# Altium project FSAES-22-E17 Temp Module.PrjPcb
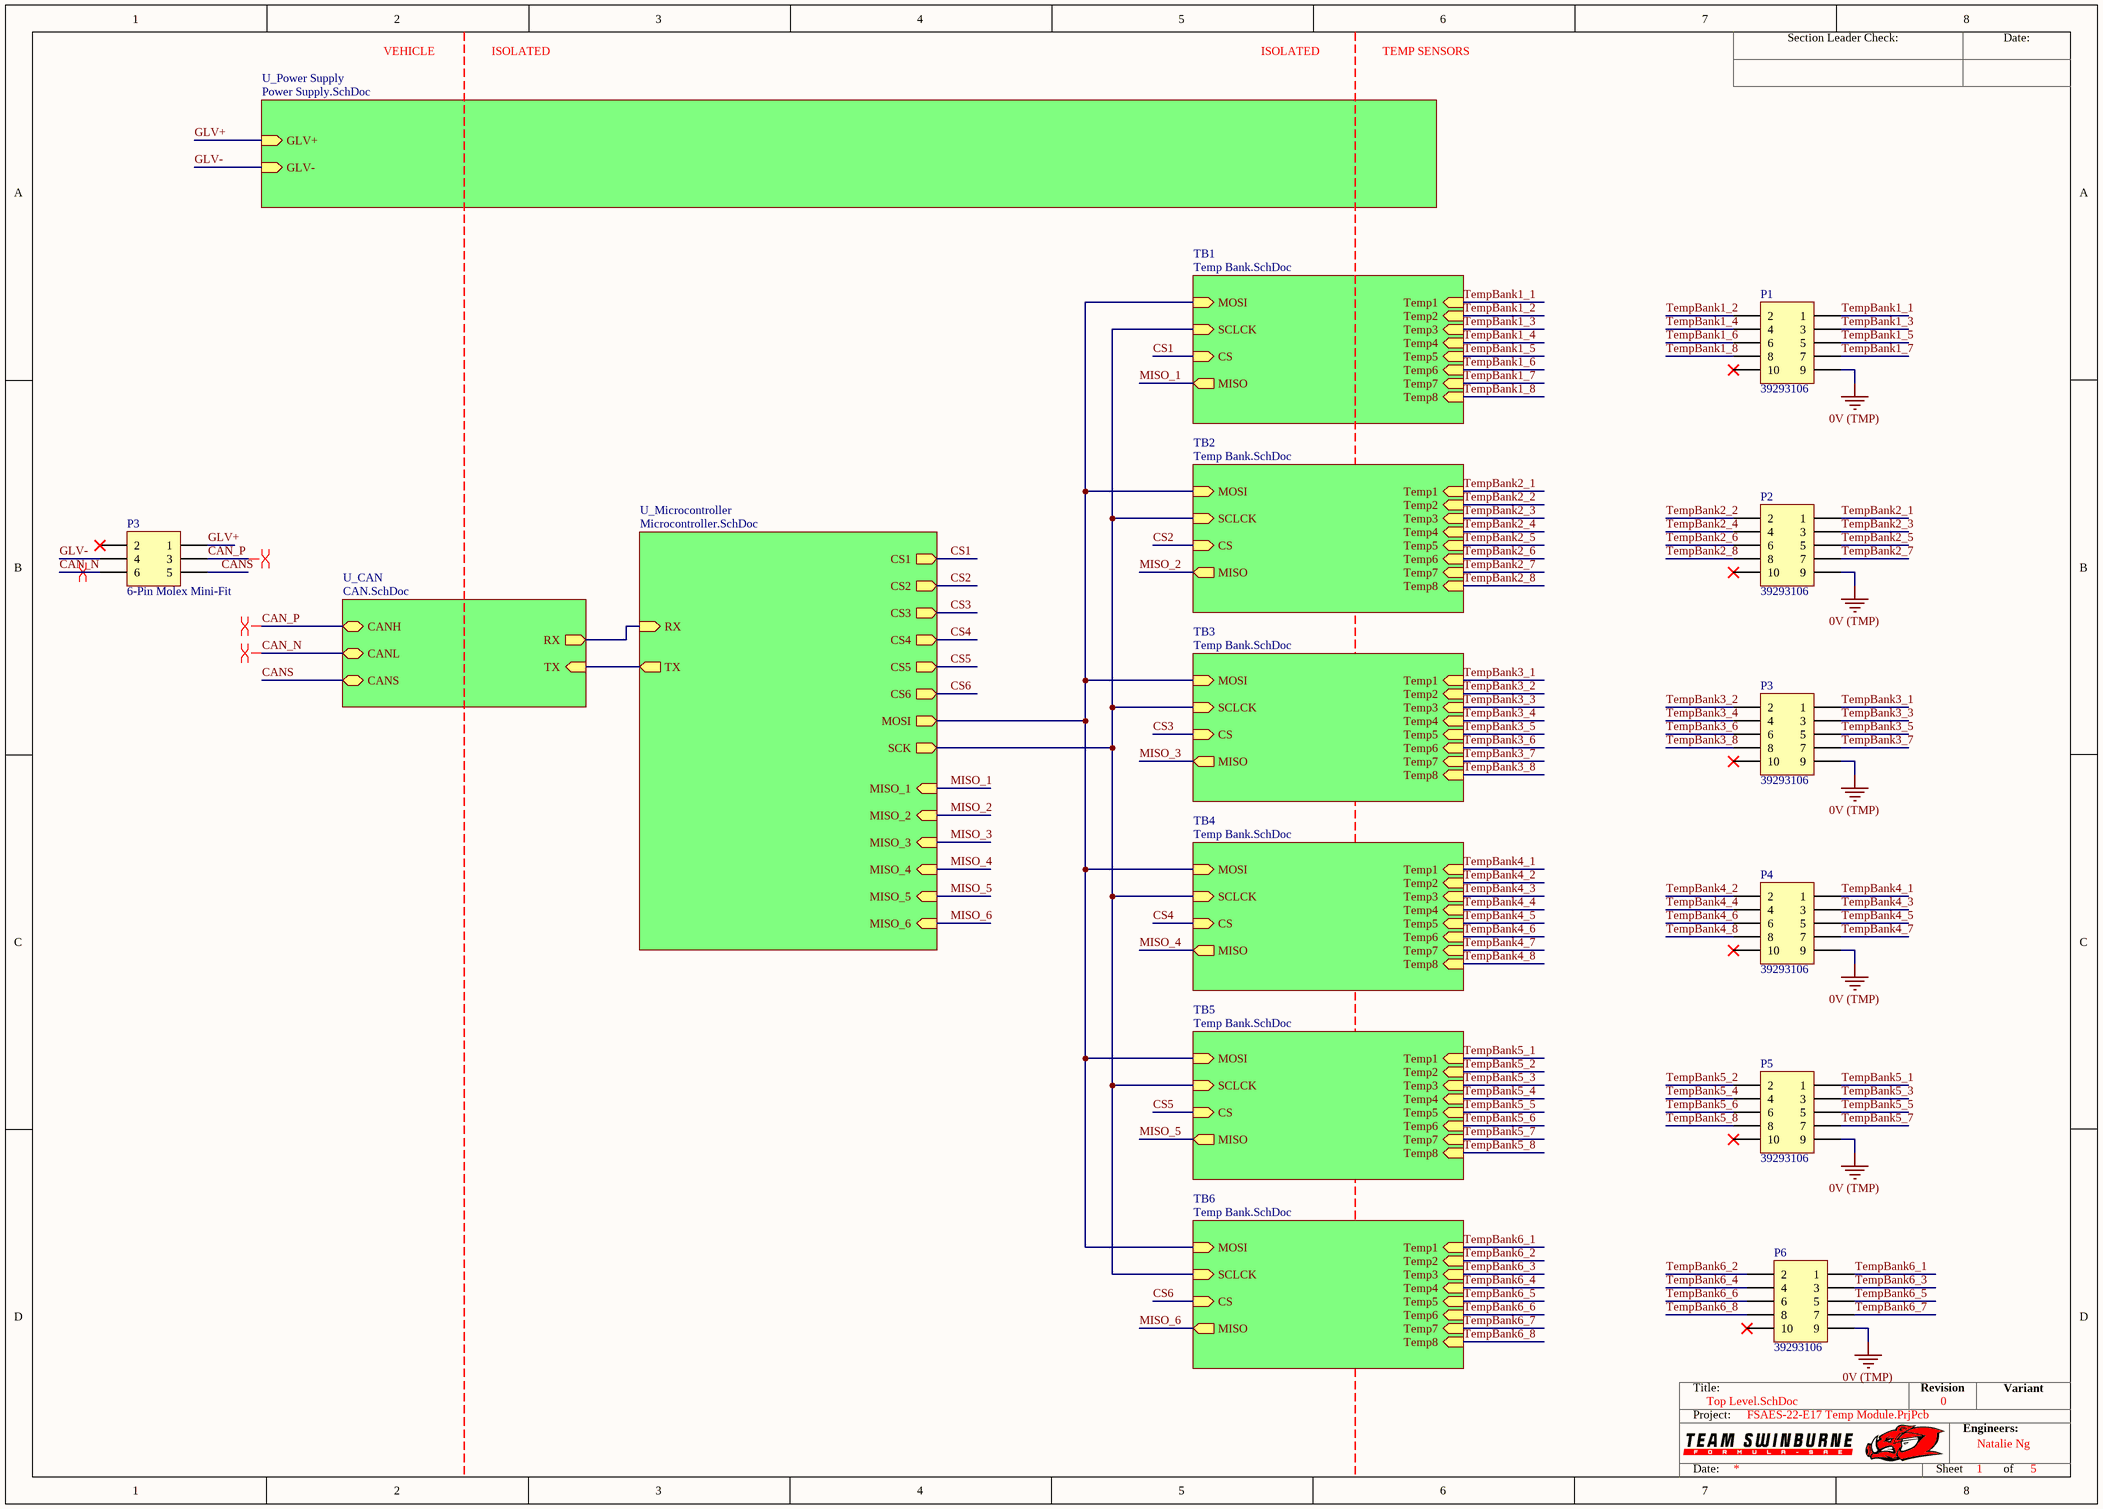
[diagram p0: Top Level.SchDoc]
Engineers: Natalie Ng; Revision: 0
5 sheets, 295 parts. Net scope: hierarchical (ports join the sheet entries above them; power ports are global).
Board file: FSAES-22-E17 Temp Module PCB.PcbDoc
Sheets:
  Top Level.SchDoc
    U_Power Supply = Power Supply.SchDoc
    U_CAN = CAN.SchDoc
    U_Microcontroller = Microcontroller.SchDoc
    TB1 = Temp Bank.SchDoc
    TB2 = Temp Bank.SchDoc
    TB3 = Temp Bank.SchDoc
    TB4 = Temp Bank.SchDoc
    TB5 = Temp Bank.SchDoc
    TB6 = Temp Bank.SchDoc

## Sheet Top Level.SchDoc
size A3; SheetNumber: 1; SheetTotal: 5

### Parts
(Parts that share a designator on the sheet are numbered #1, #2 ... from top to bottom, then left to right.)
P1  39293106  [39293106]
P2  39293106  [39293106]
P3#1  6-Pin Molex Mini-Fit  [6-Pin Molex Mini-Fit]
P3#2  39293106  [39293106]
P4  39293106  [39293106]
P5  39293106  [39293106]
P6  39293106  [39293106]

### Sub-sheets
TB1 = Temp Bank.SchDoc: MOSI (in), SCLCK (in), CS (in), MISO (out), Temp4 (in), Temp5 (in), Temp6 (in), Temp1 (in), Temp2 (in), Temp3 (in), Temp7 (in), Temp8 (in)
TB2 = Temp Bank.SchDoc: MOSI (in), SCLCK (in), CS (in), MISO (out), Temp1 (in), Temp2 (in), Temp3 (in), Temp4 (in), Temp5 (in), Temp6 (in), Temp7 (in), Temp8 (in)
TB3 = Temp Bank.SchDoc: MOSI (in), SCLCK (in), CS (in), MISO (out), Temp1 (in), Temp2 (in), Temp3 (in), Temp4 (in), Temp5 (in), Temp6 (in), Temp7 (in), Temp8 (in)
TB4 = Temp Bank.SchDoc: MOSI (in), SCLCK (in), CS (in), MISO (out), Temp1 (in), Temp2 (in), Temp3 (in), Temp4 (in), Temp5 (in), Temp6 (in), Temp7 (in), Temp8 (in)
TB5 = Temp Bank.SchDoc: MOSI (in), SCLCK (in), CS (in), MISO (out), Temp1 (in), Temp2 (in), Temp3 (in), Temp4 (in), Temp5 (in), Temp6 (in), Temp7 (in), Temp8 (in)
TB6 = Temp Bank.SchDoc: MOSI (in), SCLCK (in), CS (in), MISO (out), Temp1 (in), Temp2 (in), Temp3 (in), Temp4 (in), Temp5 (in), Temp6 (in), Temp7 (in), Temp8 (in)
U_CAN = CAN.SchDoc: CANH (bidir), RX (out), TX (in), CANL (bidir), CANS (bidir)
U_Microcontroller = Microcontroller.SchDoc: CS1 (out), CS2 (out), CS3 (out), CS4 (out), CS5 (out), MOSI (out), CS6 (out), SCK (out), RX (in), TX (out), MISO_6 (in), MISO_5 (in), MISO_4 (in), MISO_3 (in), MISO_2 (in), MISO_1 (in)
U_Power Supply = Power Supply.SchDoc: GLV+ (in), GLV- (in)

### Nets
0V (TMP): P1.9 P2.9 P3#2.9 P4.9 P5.9 P6.9
CAN_N: P3#1.6 ; sheet U_CAN/CANL
CAN_P: P3#1.3 ; sheet U_CAN/CANH
CANS: P3#1.5 ; sheet U_CAN/CANS
CRX1: sheet U_CAN/RX, sheet U_Microcontroller/RX
CS1: sheet U_Microcontroller/CS1, sheet TB1/CS  [project net C1]
CS2: sheet U_Microcontroller/CS2, sheet TB2/CS  [project net C2]
CS3: sheet U_Microcontroller/CS3, sheet TB3/CS  [project net C3]
CS4: sheet U_Microcontroller/CS4, sheet TB4/CS  [project net C4]
CS5: sheet U_Microcontroller/CS5, sheet TB5/CS  [project net C5]
CS6: sheet U_Microcontroller/CS6, sheet TB6/CS  [project net C6]
CTX1: sheet U_CAN/TX, sheet U_Microcontroller/TX
GLV+: P3#1.1 ; sheet U_Power Supply/GLV+
GLV-: P3#1.4 ; sheet U_Power Supply/GLV-
MISO_1: sheet U_Microcontroller/MISO_1, sheet TB1/MISO
MISO_2: sheet U_Microcontroller/MISO_2, sheet TB2/MISO
MISO_3: sheet U_Microcontroller/MISO_3, sheet TB3/MISO
MISO_4: sheet U_Microcontroller/MISO_4, sheet TB4/MISO
MISO_5: sheet U_Microcontroller/MISO_5, sheet TB5/MISO
MISO_6: sheet U_Microcontroller/MISO_6, sheet TB6/MISO
MOSI: sheet U_Microcontroller/MOSI, sheet TB1/MOSI, sheet TB2/MOSI, sheet TB3/MOSI, sheet TB4/MOSI, sheet TB5/MOSI, sheet TB6/MOSI
SCK: sheet U_Microcontroller/SCK, sheet TB1/SCLCK, sheet TB2/SCLCK, sheet TB3/SCLCK, sheet TB4/SCLCK, sheet TB5/SCLCK, sheet TB6/SCLCK
TempBank1_1: P1.1 ; sheet TB1/Temp1
TempBank1_2: P1.2 ; sheet TB1/Temp2
TempBank1_3: P1.3 ; sheet TB1/Temp3
TempBank1_4: P1.4 ; sheet TB1/Temp4
TempBank1_5: P1.5 ; sheet TB1/Temp5
TempBank1_6: P1.6 ; sheet TB1/Temp6
TempBank1_7: P1.7 ; sheet TB1/Temp7
TempBank1_8: P1.8 ; sheet TB1/Temp8
TempBank2_1: P2.1 ; sheet TB2/Temp1
TempBank2_2: P2.2 ; sheet TB2/Temp2
TempBank2_3: P2.3 ; sheet TB2/Temp3
TempBank2_4: P2.4 ; sheet TB2/Temp4
TempBank2_5: P2.5 ; sheet TB2/Temp5
TempBank2_6: P2.6 ; sheet TB2/Temp6
TempBank2_7: P2.7 ; sheet TB2/Temp7
TempBank2_8: P2.8 ; sheet TB2/Temp8
TempBank3_1: P3#2.1 ; sheet TB3/Temp1
TempBank3_2: P3#2.2 ; sheet TB3/Temp2
TempBank3_3: P3#2.3 ; sheet TB3/Temp3
TempBank3_4: P3#2.4 ; sheet TB3/Temp4
TempBank3_5: P3#2.5 ; sheet TB3/Temp5
TempBank3_6: P3#2.6 ; sheet TB3/Temp6
TempBank3_7: P3#2.7 ; sheet TB3/Temp7
TempBank3_8: P3#2.8 ; sheet TB3/Temp8
TempBank4_1: P4.1 ; sheet TB4/Temp1
TempBank4_2: P4.2 ; sheet TB4/Temp2
TempBank4_3: P4.3 ; sheet TB4/Temp3
TempBank4_4: P4.4 ; sheet TB4/Temp4
TempBank4_5: P4.5 ; sheet TB4/Temp5
TempBank4_6: P4.6 ; sheet TB4/Temp6
TempBank4_7: P4.7 ; sheet TB4/Temp7
TempBank4_8: P4.8 ; sheet TB4/Temp8
TempBank5_1: P5.1 ; sheet TB5/Temp1
TempBank5_2: P5.2 ; sheet TB5/Temp2
TempBank5_3: P5.3 ; sheet TB5/Temp3
TempBank5_4: P5.4 ; sheet TB5/Temp4
TempBank5_5: P5.5 ; sheet TB5/Temp5
TempBank5_6: P5.6 ; sheet TB5/Temp6
TempBank5_7: P5.7 ; sheet TB5/Temp7
TempBank5_8: P5.8 ; sheet TB5/Temp8
TempBank6_1: P6.1 ; sheet TB6/Temp1
TempBank6_2: P6.2 ; sheet TB6/Temp2
TempBank6_3: P6.3 ; sheet TB6/Temp3
TempBank6_4: P6.4 ; sheet TB6/Temp4
TempBank6_5: P6.5 ; sheet TB6/Temp5
TempBank6_6: P6.6 ; sheet TB6/Temp6
TempBank6_7: P6.7 ; sheet TB6/Temp7
TempBank6_8: P6.8 ; sheet TB6/Temp8

Not connected (* = marked no-connect by the designer): P1 10*; P2 10*; P3#1 2*; P3#2 10*; P4 10*; P5 10*; P6 10*

### Layout directives
differential pair: CAN_N, CAN_P

### Notes on the sheet
- VEHICLE
- ISOLATED
- TEMP SENSORS
- Section Leader Check:
- Date:
- Title:
- Revision
- Variant
- Project:
- Engineers:
- Sheet
- of

### Library data of the parts
P1 P2 P3#2 P4-P6 = 39293106: Pitch: 4.2mm; Row Spacing: 5.5mm; Angle: 0; Flange: No; Contact: Tin; Part Number: 39293106; Positions: 10; Digikey Part Number: WM3847-ND
P3#1 = CMP-CONN-0004-1: 6-Pin Molex Mini-Fit Connector Header 6 pin mini fit

## Sheet Power Supply.SchDoc
size A4; SheetNumber: 2; SheetTotal: 5
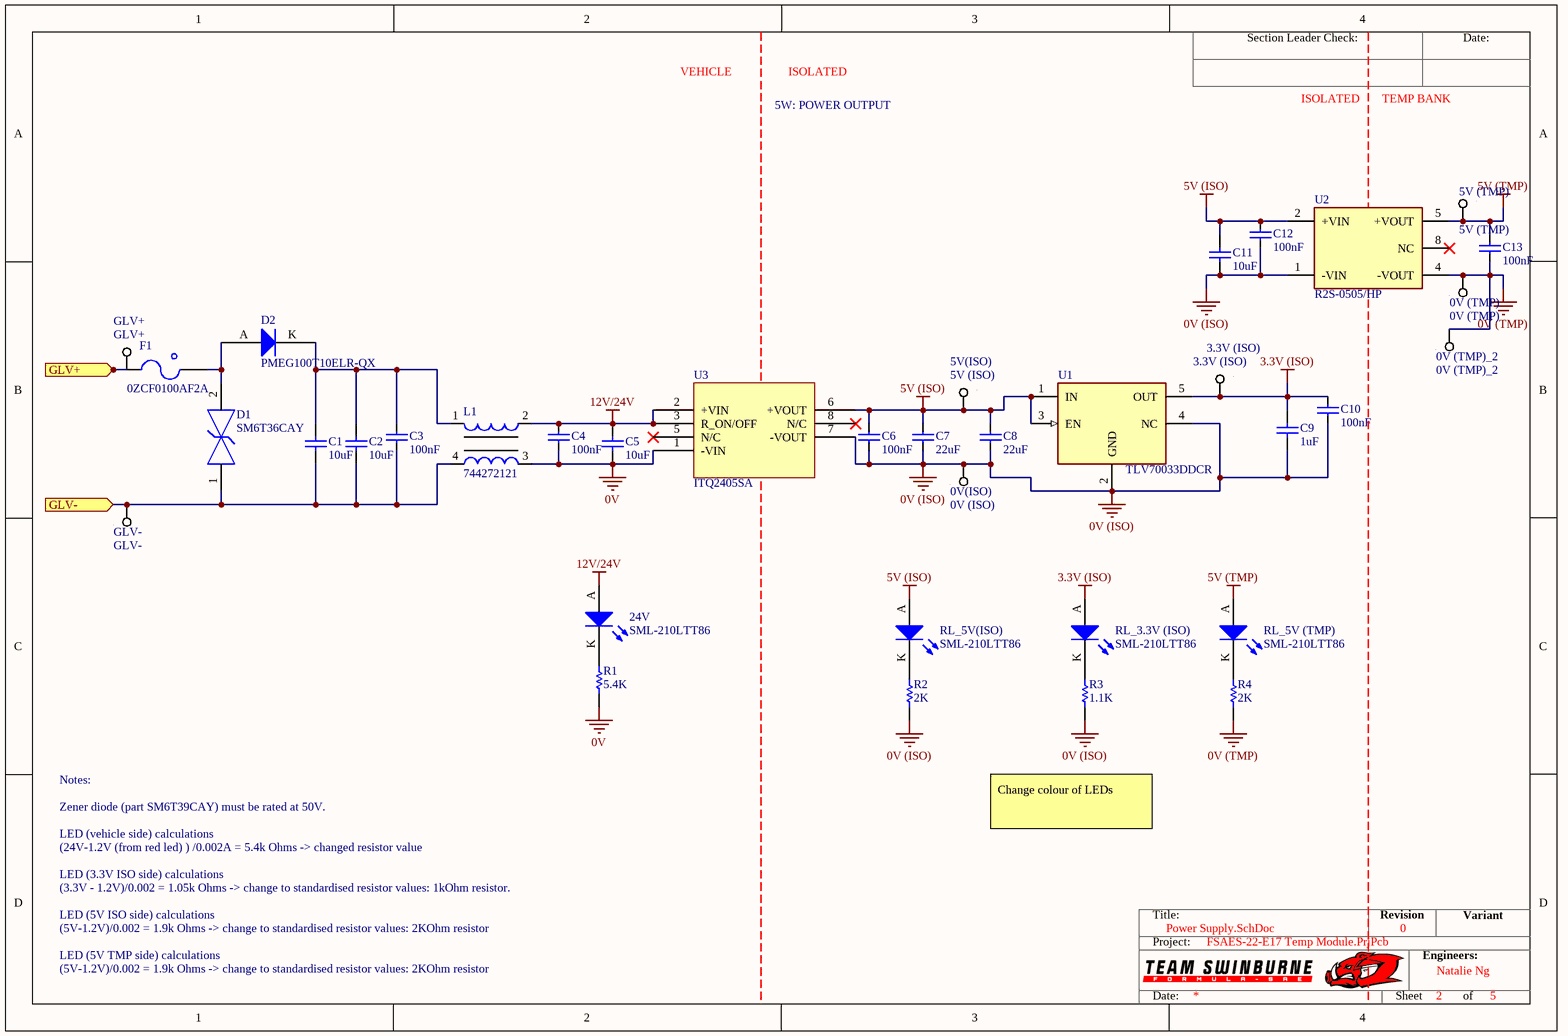
[diagram p1: Power Supply.SchDoc]

### Parts
0V(ISO)  0V (ISO)  [SMD Test Point 1mm]
0V_(TMP)  0V (TMP)  [SMD Test Point 1mm]
0V_(TMP)_2  0V (TMP)_2
3.3V_(ISO)  3.3V (ISO)  [SMD Test Point 1mm]
5V(ISO)  5V (ISO)  [SMD Test Point 1mm]
5V_(TMP)  5V (TMP)  [SMD Test Point 1mm]
24V  SML-210LTT86  [0805 LED]
C1  10uF  [CAPC2013X145X50NL20T25]
C2  10uF  [CAPC2013X145X50NL20T25]
C3  100nF  [0805]
C4  100nF  [0805]
C5  10uF  [CAPC2013X145X50NL20T25]
C6  100nF  [0805]
C7  22uF  [C0805C226M9PAC7210-Footprint-1]
C8  22uF  [C0805C226M9PAC7210-Footprint-1]
C9  1uF  [0805]
C10  100nF  [0805]
C11  10uF  [0805]
C12  100nF  [0805]
C13  100nF  [0805]
D1  SM6T36CAY  [FP-SMB-CA-MFG]
D2  PMEG100T10ELR-QX  [SODFL350X110-2N]
F1  0ZCF0100AF2A  [2920]
GLV+  GLV+  [SMD Test Point 1mm]
GLV-  GLV-  [SMD Test Point 1mm]
L1  744272121  [WE-SL5]
R1  5.4K  [RNCF0805BKY5K40-Footprint-1]
R2  2K  [0805]
R3  1.1K  [RESC0603]
R4  2K  [0805]
RL_3.3V_(ISO)  SML-210LTT86  [0805 LED]
RL_5V(ISO)  SML-210LTT86  [0805 LED]
RL_5V_(TMP)  SML-210LTT86  [0805 LED]
U1  TLV70033DDCR  [FP-DDC0005A-IPC_B]
U2  R2S-0505/HP  [R2S-0505_HP-Footprint-1]
U3  ITQ2405SA  [ITQ2405SA-Footprint-1]

### Ports
GLV+ (in), GLV- (in)

### Nets
0V: C4.2 C5.1 L1.3 R1.1 U3.1(-VIN)
0V (ISO): 0V(ISO).1 C6.2 C7.1 C8.1 C9.1 C10.2 C11.1 C12.2 R2.1 R3.1 U1.2(GND) U1.4(NC) U2.1(-VIN) U3.7(-VOUT)  [project net G1]
0V (TMP): 0V_(TMP).1 0V_(TMP)_2.1 C13.2 R4.1 U2.4(-VOUT)
3.3V (ISO): 3.3V_(ISO).1 C9.2 C10.1 RL_3.3V_(ISO).A U1.5(OUT)
5V (ISO): 5V(ISO).1 C6.1 C7.2 C8.2 C11.2 C12.1 RL_5V(ISO).A U1.1(IN) U1.3(EN) U2.2(+VIN) U3.6(+VOUT)
5V (TMP): 5V_(TMP).1 C13.1 RL_5V_(TMP).A U2.5(+VOUT)
12V/24V: 24V.A C4.1 C5.2 L1.2 U3.2(+VIN) U3.3(R_ON/OFF)
GLV+: F1.1 GLV+.1 ; port GLV+
GLV-: C1.1 C2.1 C3.2 D1.1 GLV-.1 L1.4 ; port GLV-
Net24V_K: 24V.K R1.2
NetC1_2: C1.2 C2.2 C3.1 D2.K L1.1
NetD1_2: D1.2 D2.A F1.2
NetR2_2: R2.2 RL_5V(ISO).K
NetR3_2: R3.2 RL_3.3V_(ISO).K
NetR4_2: R4.2 RL_5V_(TMP).K

Not connected (* = marked no-connect by the designer): U2 8(NC)*; U3 5(N/C)* 8(N/C)*

### Notes on the sheet
- VEHICLE
- 5W: POWER OUTPUT
- ISOLATED
- TEMP BANK
- Notes:
- (24V-1.2V (from red led) ) /0.002A = 5.4k Ohms -> changed resistor value
- LED (vehicle side) calculations
- Zener diode (part SM6T39CAY) must be rated at 50V.
- Change colour of LEDs
- LED (3.3V ISO side) calculations
- (3.3V - 1.2V)/0.002 = 1.05k Ohms -> change to standardised resistor values: 1kOhm resistor.
- LED (5V ISO side) calculations
- (5V-1.2V)/0.002 = 1.9k Ohms -> change to standardised resistor values: 2KOhm resistor
- LED (5V TMP side) calculations
- Section Leader Check:
- Date:
- Title:
- Revision
- Variant
- Project:
- Engineers:
- Sheet
- of
- (in symbol GRM21BR6YA106KE43L) 0805

### Library data of the parts
0V(ISO) 0V_(TMP) 3.3V_(ISO) 5V(ISO) 5V_(TMP) GLV+ GLV- = SMD Test Point Small: Positions: 1; Pitch: 0mm; Row Spacing: 0; Flange: No; Contact: NA; Part Number: SMD Test Point Small; Angle: 0
0V_(TMP)_2 = CMP-061-000001-1: Design Item ID: Test Point Small; Source: Generic.SchLib
24V RL_3.3V_(ISO) RL_5V(ISO) RL_5V_(TMP) = CMP-025-000006-1: Red LED Indication - Discrete 1.75V 0805 (2012 Metric); Part Number: SML-210LTT86
C1 C2 C5 = CMP-CAP-0009-1: CAP CER 10UF 10V Y5V 0805; Dissipation Factor: 20%; Tolerance: 80%; Dielectric Material: Ceramic; Lead Free: Lead Free; Construction: Flat; Number of Pins: 2; Package Quantity: 1; Max Operating Temperature: 85°C; Resistor Type: Ceramic; Dielectric: Y5V; Capacitance: 10uF; Width: 0.049inch; REACH SVHC: No SVHC; Length: 2mm; Mount: Surface Mount; Case Code (Imperial): 0805; Case/Package: 0805; Termination: SMD/SMT; RoHS Compliant: Yes; Series: CC; Voltage Rating: 10V; Packaging: Tape and Reel; Depth: 1.25mm; Voltage Rating (DC): 10V; Height: 0.85mm; Thickness: 0.049inch; Case Code (Metric): 2012; Halogen Free: Halogen Free; Radiation Hardening: No; Min Operating Temperature: -30°C
C3 C4 C6 C10 C12 C13 = CMP-00018-1: Cap Ceramic 0.1uF 25V X7R 10% Pad SMD 0805 125C Automotive T/R; Max Operating Temperature: 125°C; RoHS Compliant: Yes; Series: GCM; Case Code (Metric): 2012; Thickness: 0.055inch; Depth: 1.25mm; Width: 1.25mm; Package Quantity: 3000; Case Code (Imperial): 0805; Voltage Rating (DC): 25V; Dielectric: X7R; Construction: Flat; Height: 1.25mm; Ratings: AEC-Q200; Mount: Surface Mount; Voltage Rating: 25V; Tolerance: 10%; Length: 2mm; Case/Package: 0805; Packaging: Tape and Reel; Min Operating Temperature: -55°C; Radiation Hardening: No; Capacitance: 100nF; Termination: SMD/SMT
C7 C8 = CMP-CAP-0012-1: Cap Ceramic 22uF 6.3V X5R 20% Pad SMD 0805 85C T/R; Length: 2mm; Tolerance: 20%; Depth: 1.25mm; ComponentLink1URL: https://www.digikey.com.au/en/products/detail/kemet/C0805C226M9PAC7210/12701503?utm_adgroup=Ceramic%20Capacitors&utm_source=google&utm_medium=cpc&utm_campaign=Shopping_Product_Capacitors&utm_term=&productid=12701503&utm_id=go_cmp-1056236628_adg-53401090298_ad-250137101738_pla-354083418645_dev-c_ext-_prd-12701503_sig-CjwKCAjwnZaVBhA6EiwAVVyv9KTEcqdxbqdQeMdm15seaf-EwUH-KMZCmj15MsoZE7WO92Q0RAY2FRoCkrcQAvD_BwE&gclid=CjwKCAjwnZaVBhA6EiwAVVyv9KTEcqdxbqdQeMdm15seaf-EwUH-KMZCmj15MsoZE7WO92Q0RAY2FRoCkrcQAvD_BwE; Min Operating Temperature: -55°C; RoHS Compliant: Yes; Packaging: Tape and Reel; Dielectric: X5R; Capacitance: 22uF; ComponentLink1Description: Digikey Link; Max Operating Temperature: 85°C; Case/Package: 0805
C9 = AC0805KKX7R8BB105: Manufacturer: YAGEO; Tolerance: 10%; Material: X7R; Rated Voltage: 25V; Part Number: AC0805KKX7R8BB105; Value: 1uF; Digikey Part Number: DO NOT USE FOR NEW DESIGNS
C11 = GRM21BR6YA106KE43L: Manufacturer: muRata; Tolerance: 10%; Material: X5R; Rated Voltage: 50V; Part Number: GRM21BR6YA106KE43L; Value: 10uF; Digikey Part Number: 490-10514-6-ND
D1 = CMP-004-00004-1: ESD Suppressors / TVS Diodes 600 W 4kW Transil 6V to 70V Bi; Number of Bidirectional Channels: 1; Leakage Current: 200nA; Peak Pulse Power: 600W; Test Current: 1mA; Clamping Voltage: 49.9V; Direction: Bidirectional; Operating Supply Voltage: 30V; Peak Pulse Current: 62A; Max Breakdown Voltage: 37.8V; Breakdown Voltage: 36V; Max Surge Current: 12A; Min Breakdown Voltage: 34.2V; Power Line Protection: No; Diode Type: ZENER; Reverse Standoff Voltage: 30.8V; Lead Free: Contains Lead; Mounting Technology: Surface Mount; Termination: SMD/SMT; Series: Automotive, AEC-Q101, SM6TY, TRANSIL™; Height: 2.45mm; Min Operating Temperature: -55°C; Reach SVHC Compliant: No; Max Power Dissipation: 600W; Case/Package: DO-214AA; Max Reverse Leakage Current: 200nA; Polarity: Bidirectional; Number of Elements: 1; Package Quantity: 1; RoHS Compliant: Yes; Packaging: Tape and Reel; Max Operating Temperature: 150°C; Width: 3.95mm; Reverse Breakdown Voltage: 34.2V; Number of Channels: 1; Length: 4.6mm; Pins: 2
D2 = CMP-004-00005-4: Diode 100 V 1A Surface Mount SOD-123W
F1 = CMP-018-000004-1: PTC RESET FUSE 60V 1A 292; Part Number: 0ZCF0100AF2A
L1 = CMP-00010-1: CMC 120UH 2.5A 2LN 460 OHM SMD; Voltage Rating (DC): 80V; Inductance Tolerance: 40%; Max Current Rating: 3A; Number of Lines: 2; Test Frequency: 100kHz; Resistance: 25mR; Core Material: Ferrite; Impedance: 460R; Max Operating Temperature: 125°C; Depth: 8.7mm; Min Operating Temperature: -40°C; Current Rating: 2.5A; Tolerance: 40%; Number of Pins: 4; Case/Package: SMD/SMT; Weight: 0.026103oz; Inductance: 120uH; Package Quantity: 1; Current: 2.5A; Width: 0.343inch; RoHS Compliant: Yes; Length: 0.394inch; DC Resistance (DCR): 25mR; Mount: Surface Mount; Termination: SMD/SMT; Packaging: Tape and Reel; Lead Free: Lead Free; Self Resonant Frequency: 100kHz; Height: 6.5mm; Series: WE-SL5; Max DC Current: 2.5A; Voltage Rating: 80V; REACH SVHC: No SVHC
R1 = CMP-RES-0158-2: RES SMD 5.4K OHM 0.125W 0805; Temperature Coefficient: 5ppm/°C; Max Power Dissipation: 125mW; Tolerance: 0.1%; Resistance: 5.4kR; Power Rating: 100mW; Series: RNCF; Packaging: Tape and Reel; RoHS Compliant: Yes; Min Operating Temperature: -55°C; Features: Automotive AEC-Q200; Mount: Surface Mount; Case/Package: 0805; Number of Terminations: 2; Max Operating Temperature: 155°C
R2 R4 = CMP-037-000309-3: RC0805FR072KL; Tolerance: 0.01; Rated Voltage: 0.125W; Value: 2k; Digikey Part Number: 311-2.00KCRCT-ND; Material: FR-07
R3 = CMP-RES-0079-1: RES SMD 1.1K OHM JUMPER 1/10W 0603; Voltage Rating: 50V; Tolerance: 1%; Power Rating: 100mW; Max Operating Temperature: 155°C; Case/Package: 0603; Min Operating Temperature: -55°C
U1 = CMP-001-0011-2: Fixed Positive LDO Regulator, 3.3V, 0.25V Dropout, PMOS, PDSO5; Dropout Voltage1-Nom: 175mV; Input Voltage Absolute-Max: 6V; Package Equivalence Code: TSOP5/6,.11,37; Package Body Material: Plastic; Voltage Tolerance-Max: 2%; Max Supply Voltage: 5.5V; Channels: 1; Dropout Voltage1-Max: 250mV; Regulator Type: FIXED POSITIVE SINGLE OUTPUT LDO REGULATOR; Output Current1-Max: 200mA; Min Input Voltage: 2V; Output Voltage1-Min: 3.234V; Load Regulation-Max: 0.015%; Line Regulation-Max: 0.005%; Output Voltage1-Max: 3.366V; Qualification Status: Not Qualified; Reach SVHC Compliant: Yes; JESD-30 Code: R-PDSO-G5; Terminal Position: DUAL; Pins: 5; Moisture Sensitivity Level: 2; Length: 2.9mm; Operating Temperature, TJ-Min: -40°C; Operating Temperature, TJ-Max: 125°C; Package Shape: Rectangular; Output Voltage1-Nom: 3.3V; Packaging: Tape and Reel; Surface Mount: Yes; Number of Outputs: 1; JESD-609 Code: e4; Adjustability: FIXED; Technology: PMOS; Peak Reflow Temperature (Cel): 260°C; Terminal Form: Gull Wing; Case/Package: TSSOP; Height - Seated (Max): 1.1mm; Package Style: SMALL OUTLINE, THIN PROFILE, SHRINK PITCHMeter; Terminal Finish: Nickel; RoHS Compliant: Yes; Terminal Pitch: 0.95mm; Width: 1.6mm
U2 = CMP-00025-2: DC-DC Unregulated Power Supply Module, 1 Output, 2W, Hybrid; Max Output Voltage: 5.25V; Min Input Voltage: 4.5V; Qualification Status: Not Qualified; Number of Functions: 1; Max Input Voltage: 5.5V; Nominal Output Voltage: 5V; Trim/Adjustable Output: No; Max Output Current: 400mA; Min Output Voltage: 4.75V; Load Regulation-Max: 15%; Terminal Position: DUAL; Width: 10.7mm; Number of Pins: 5; Package Shape: Rectangular; Max Operating Temperature: 100°C; Package Style: MICROELECTRONIC ASSEMBLYMeter; RoHS Compliant: Yes; Package Code: SOP; Height - Seated (Max): 9.5mm; Analog IC - Other Type: DC-DC UNREGULATED POWER SUPPLY MODULE; Temperature Grade: INDUSTRIAL; Terminal Form: Flat; Reach SVHC Compliant: Yes; Min Operating Temperature: -40°C; Length: 12.75mm; Max Output Power: 2W; Number of Outputs: 1; Surface Mount: Yes; Terminal Pitch: 2.54mm; Nominal Input Voltage: 5V; Technology: HYBRID
U3 = CMP-001-0010-2: Dc-dc Converter, 6W Single O/p, 4: 1 Input Sip; Max Output current: 1.2A; Min Input Voltage (DC): 9V; Voltage - Output 1: 5V; Max Supply Voltage: 36V; Isolation Voltage: 1.5kV; Number of Outputs: 1; Efficiency: 84%; Reach SVHC Compliant: Unknown; Current - Output 1: 1.2A; Min Operating Temperature: -40°C; Packaging: Rail/Tube; Features: SCP; RoHS Compliant: Yes; Max Power Dissipation: 6W; Width: 0.36inch; Mounting Technology: Through Hole,PCB; Case/Package: SIP; Output Power: 6W; Max Operating Temperature: 100°C; Max Output Power: 6W; Height: 0.44inch; Max Input Voltage (DC): 36V; Length: 0.86inch; Series: ITQ; Min Input Voltage: 9V; Depth: 21.85mm

## Sheet CAN.SchDoc
size A4; SheetNumber: 3; SheetTotal: 5
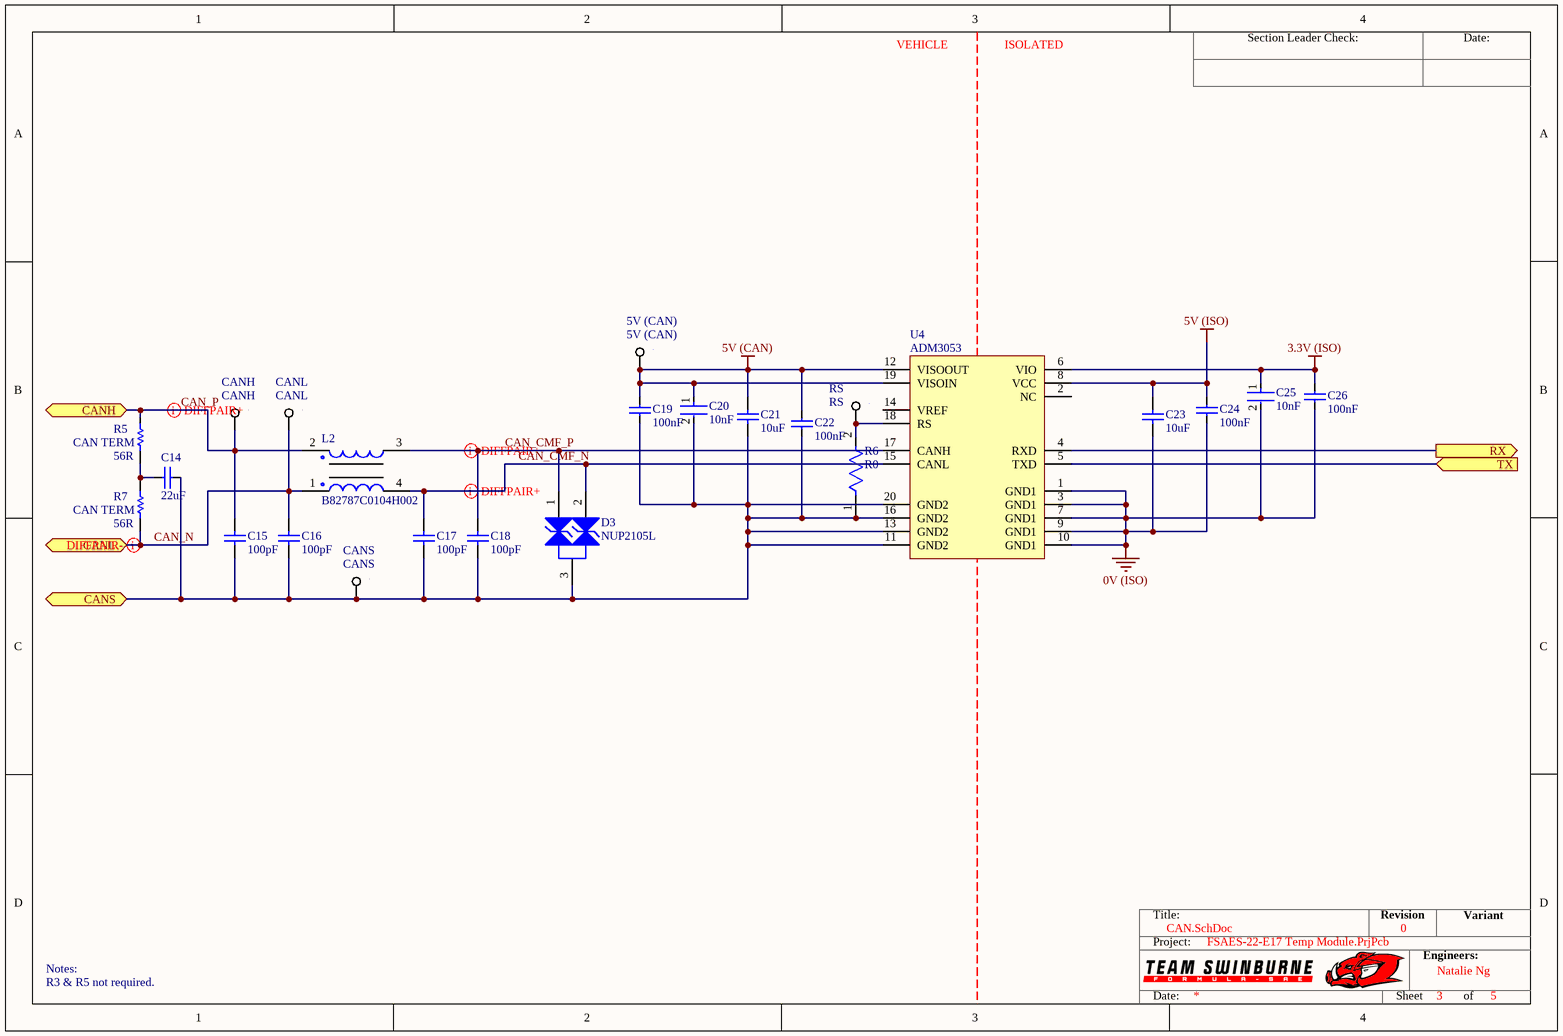
[diagram p2: CAN.SchDoc]

### Parts
5V_(CAN)  5V (CAN)  [SMD Test Point 1mm]
C14  22uF  [C0805C226M9PAC7210-Footprint-1]
C15  100pF  [CAPC2013X70X45NL15T25]
C16  100pF  [CAPC2013X70X45NL15T25]
C17  100pF  [CAPC2013X70X45NL15T25]
C18  100pF  [CAPC2013X70X45NL15T25]
C19  100nF  [0805]
C20  10nF  [FP-GCM319-0_15-IPC_A]
C21  10uF  [CAPC2013X145X50NL20T25]
C22  100nF  [0805]
C23  10uF  [CAPC2013X145X50NL20T25]
C24  100nF  [0805]
C25  10nF  [FP-GCM319-0_15-IPC_A]
C26  100nF  [0805]
CANH  CANH  [SMD Test Point 1mm]
CANL  CANL  [SMD Test Point 1mm]
CANS  CANS  [SMD Test Point 1mm]
D3  NUP2105L  [ONSC-SOT-23-3-318-08_V]
L2  B82787C0104H002  [TDK 4-PC Pad]
R5  CAN TERM  value 56R  [RESC0603]
R6  R0  [FP-RC0805-IPC_A]
R7  CAN TERM  value 56R  [RESC0603]
RS  RS  [SMD Test Point 1mm]
U4  ADM3053  [AD SOIC-W 20]

### Ports
CANH (bidir), CANL (bidir), CANS (bidir), RX (out), TX (in)

### Nets
0V (ISO): C23.1 C24.2 C25.2 C26.2 U4.1(GND1) U4.3(GND1) U4.7(GND1) U4.9(GND1) U4.10(GND1)  [project net G1]
3.3V (ISO): C25.1 C26.1 U4.6(VIO)
5V (CAN): 5V_(CAN).1 C19.1 C20.1 C21.2 C22.1 U4.12(VISOOUT) U4.19(VISOIN)
5V (ISO): C23.2 C24.1 U4.8(VCC)
CAN_CMF_N: C17.2 D3.2(K) L2.4 U4.15(CANL)
CAN_CMF_P: C18.2 D3.1(K) L2.3 U4.17(CANH)
CAN_N: C16.2 CANL.1 L2.1 R7.1 ; port CANL
CAN_P: C15.2 CANH.1 L2.2 R5.2 ; port CANH
CANS: C14.2 C15.1 C16.1 C17.1 C18.1 C19.2 C20.2 C21.1 C22.2 CANS.1 D3.3(K) R6.1 U4.11(GND2) U4.13(GND2) U4.16(GND2) U4.20(GND2) ; port CANS
CRX1: U4.4(RXD) ; port RX
CTX1: U4.5(TXD) ; port TX
NetC14_1: C14.1 R5.1 R7.2
NetR6_2: R6.2 RS.1 U4.18(RS)

Not connected (* = marked no-connect by the designer): U4 2(NC) 14(VREF)

### Layout directives
differential pair: CAN_CMF_N, CAN_CMF_P, CAN_N, CAN_P

### Notes on the sheet
- VEHICLE
- ISOLATED
- Notes:
- R3 & R5 not required.
- Section Leader Check:
- Date:
- Title:
- Revision
- Variant
- Project:
- Engineers:
- Sheet
- of

### Library data of the parts
5V_(CAN) CANH CANL CANS RS = SMD Test Point Small: as 0V(ISO) on sheet Power Supply; Part Number: SMD Test Point Small; Angle: 0
C14 = CMP-CAP-0012-1: as C7 on sheet Power Supply; Length: 2mm; Tolerance: 20%; Depth: 1.25mm; ComponentLink1URL: https://www.digikey.com.au/en/products/detail/kemet/C0805C226M9PAC7210/12701503?utm_adgroup=Ceramic%20Capacitors&utm_source=google&utm_medium=cpc&utm_campaign=Shopping_Product_Capacitors&utm_term=&productid=12701503&utm_id=go_cmp-1056236628_adg-53401090298_ad-250137101738_pla-354083418645_dev-c_ext-_prd-12701503_sig-CjwKCAjwnZaVBhA6EiwAVVyv9KTEcqdxbqdQeMdm15seaf-EwUH-KMZCmj15MsoZE7WO92Q0RAY2FRoCkrcQAvD_BwE&gclid=CjwKCAjwnZaVBhA6EiwAVVyv9KTEcqdxbqdQeMdm15seaf-EwUH-KMZCmj15MsoZE7WO92Q0RAY2FRoCkrcQAvD_BwE; Min Operating Temperature: -55°C; RoHS Compliant: Yes; Packaging: Tape and Reel; Dielectric: X5R; Capacitance: 22uF; ComponentLink1Description: Digikey Link; Max Operating Temperature: 85°C; Case/Package: 0805
C15-C18 = CMP-CAP-0014-1: Cap Ceramic 100pF 50V C0G 5% Pad SMD 0805 125C Automotive T/R; Package Quantity: 1; Case/Package: 0805; Dielectric: C0G; Packaging: Tape and Reel; Capacitance: 100pF; Length: 2mm; Tolerance: 5%; Construction: Flat; Thickness: 0.028inch; Series: GCM; Case Code (Imperial): 0805; Ratings: AEC-Q200; Width: 0.049inch; Min Operating Temperature: -55°C; Depth: 1.25mm; Radiation Hardening: No; Termination: SMD/SMT; Voltage Rating: 50V; Mount: Surface Mount; Height: 0.6mm; Max Operating Temperature: 125°C; RoHS Compliant: Yes; Case Code (Metric): 2012; Voltage Rating (DC): 50V
C19 C22 C24 C26 = CMP-00018-1: as C3 on sheet Power Supply; Max Operating Temperature: 125°C; RoHS Compliant: Yes; Series: GCM; Case Code (Metric): 2012; Thickness: 0.055inch; Depth: 1.25mm; Width: 1.25mm; Package Quantity: 3000; Case Code (Imperial): 0805; Voltage Rating (DC): 25V; Dielectric: X7R; Construction: Flat; Height: 1.25mm; Ratings: AEC-Q200; Mount: Surface Mount; Voltage Rating: 25V; Tolerance: 10%; Length: 2mm; Case/Package: 0805; Packaging: Tape and Reel; Min Operating Temperature: -55°C; Radiation Hardening: No; Capacitance: 100nF; Termination: SMD/SMT
C20 C25 = CMP-CAP-0013-1: CAP CER 10000PF 100V NP0 1206; Dielectric: C0G; Tolerance: 5%; Width: 0.063inch; Max Operating Temperature: 125°C; Construction: Flat; Termination: SMD/SMT; RoHS Compliant: Yes; Voltage Rating: 100V; Radiation Hardening: No; Ratings: AEC-Q200; Package Quantity: 1; Case/Package: 1206; Capacitance: 10nF; Voltage Rating (DC): 100V; Case Code (Metric): 3216; Case Code (Imperial): 1206; Packaging: Tape and Reel; Depth: 1.6mm; Min Operating Temperature: -55°C; Lead Free: Lead Free; Thickness: 0.037inch; Mount: Surface Mount; Height: 0.85mm; Length: 3.2mm; Series: GCM
C21 C23 = CMP-CAP-0009-1: as C1 on sheet Power Supply; Lead Free: Lead Free; Construction: Flat; Number of Pins: 2; Package Quantity: 1; Max Operating Temperature: 85°C; Resistor Type: Ceramic; Dielectric: Y5V; Capacitance: 10uF; Width: 0.049inch; REACH SVHC: No SVHC; Length: 2mm; Mount: Surface Mount; Case Code (Imperial): 0805; Case/Package: 0805; Termination: SMD/SMT; RoHS Compliant: Yes; Series: CC; Voltage Rating: 10V; Packaging: Tape and Reel; Depth: 1.25mm; Voltage Rating (DC): 10V; Height: 0.85mm; Thickness: 0.049inch; Case Code (Metric): 2012; Halogen Free: Halogen Free; Radiation Hardening: No; Min Operating Temperature: -30°C
D3 = CMP-004-00000-1: NUP2105L Series 350 W Dual Line CAN Bus Protector ESD Protection Diode - SOT-23; Max Breakdown Voltage: 32V; Clamping Voltage: 44V; Number of Lines: 2; Direction: Bidirectional; Reverse Standoff Voltage: 24V; Min Breakdown Voltage: 26.2V; Peak Pulse Current: 8A; ESD Protection: Yes; Test Current: 1mA; Diode Type: ZENER; Max Power Dissipation: 350W; Capacitance: 30pF; Leakage Current: 100nA; Power Line Protection: No; Depth: 1.3mm; Package Quantity: 1; Element Configuration: Dual; Termination: SMD/SMT; Radiation Hardening: No; Min Operating Temperature: -55°C; Contact Plating: Tin,Matte; Packaging: Tape and Reel; Polarity: Bidirectional; Resistor Type: Zener; Clamping Voltage-Max: 44V; Height: 0.94mm; Max Surge Current: 8A; RoHS Compliant: Yes; Width: 1.3mm; Lead Free: Lead Free; Case/Package: SOT-23-3; Number of Channels: 2; Series: Automotive, AEC-Q101; Halogen Free: Halogen Free; Breakdown Voltage: 26.2V; Working Voltage: 24V; Operating Supply Voltage: 24V; Max Operating Temperature: 150°C; REACH SVHC: No SVHC; Number of Pins: 3; Max Reverse Leakage Current: 100nA; Peak Pulse Power: 350W; Length: 2.9mm; Number of Bidirectional Channels: 2
L2 = B82787C0104H002: 100µH @ 100kHz 2 Line Common Mode Choke Surface Mount 5.8 kOhms @ 10MHz 150mA DCR 2Ohm; Manufacturer: EPCOS (TDK); Material: Wirewound; Part Number: B82787C0104H002; Impedence: 5.8 kOhms @ 10MHz; Rated Current: 150mA; Digikey Part Number: 495-4598-1-ND; Digikey Link: https://www.digikey.com/product-detail/en/epcos-tdk/B82787C0104H002/495-4598-2-ND/3680998; Value: 100µH @ 100kHz
R5 R7 = CMP-RES-0049-1: RES SMD 56 OHM JUMPER 1/10W 0603; Tolerance: 1%; Power Rating: 100mW; Voltage Rating: 50V; Max Operating Temperature: 155°C; Case/Package: 0603; Min Operating Temperature: -55°C
R6 = CMP-00003-1: Res Thick Film 0805 0 Ohm Epoxy Pad SMD T/R; Tolerance: 1%; Max Power Dissipation: 125mW; Resistance: 0mR; Max Operating Temperature: 155°C; Features: Moisture Resistant; Case/Package: 0805; Length: 2mm; Depth: 1.25mm; Resistor Type: Thick Film; Case Code (Imperial): 0805; Min Operating Temperature: -55°C; Military Standard: Not; Number of Terminations: 2; Case Code (Metric): 2012; Radiation Hardening: No; Series: RC; RoHS Compliant: Yes; Power Rating: 125mW; Packaging: Tape and Reel; Lead Free: Lead Free; Size Code: 0805; Contact Plating: Tin,Matte; Construction: Rectangular
U4 = ADM3053: Isolated CAN Transceiver; Manufacturer: Analogue Devices; Part Number: ADM3053; Digikey Part Number: ADM3053BRWZ-ND; Digikey Link: https://www.digikey.com/product-detail/en/analog-devices-inc/ADM3053BRWZ/ADM3053BRWZ-ND/2709332

## Sheet Microcontroller.SchDoc
size A3; SheetNumber: 4; SheetTotal: 5
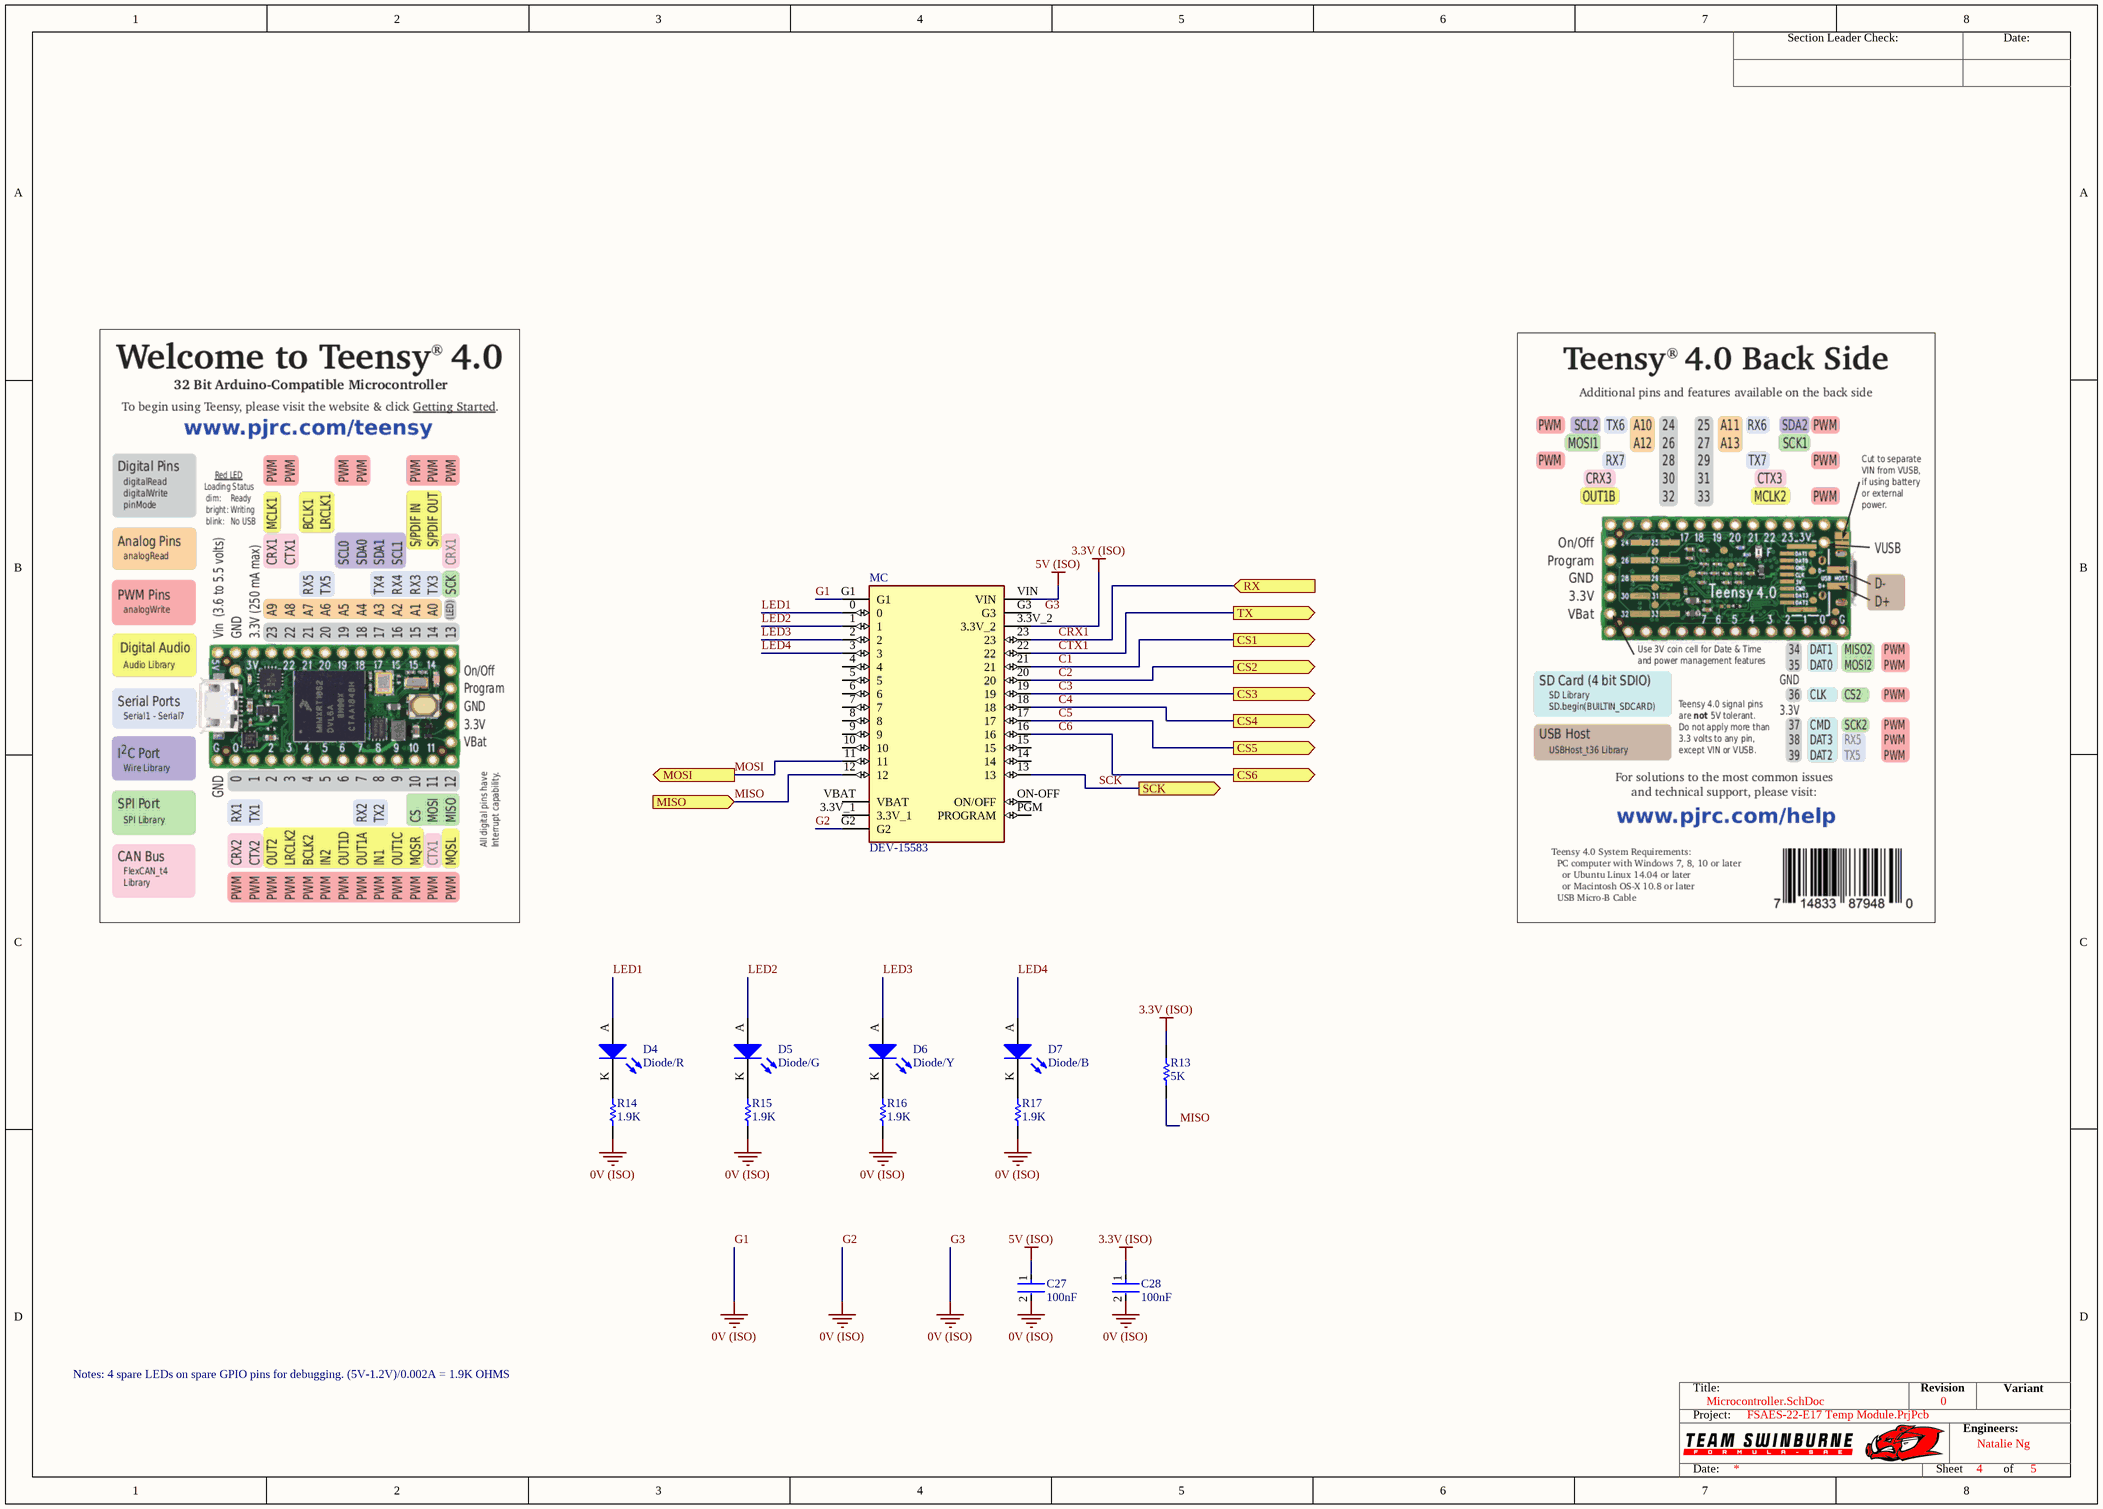
[diagram p3: Microcontroller.SchDoc]

### Parts
C27  100nF  [FP-GCM319-0_15-IPC_A]
C28  100nF  [FP-GCM319-0_15-IPC_A]
D4  Diode/R  [0805 LED]
D5  Diode/G  [0805 LED]
D6  Diode/Y  [0805 LED]
D7  Diode/B  [0805 LED]
MC  DEV-15583  [DEV-15583-Footprint-1]
R13  5K  [Y16295K00000T9R-Footprint-1]
R14  1.9K  [Y16241K90000T9R-Footprint-1]
R15  1.9K  [Y16241K90000T9R-Footprint-1]
R16  1.9K  [Y16241K90000T9R-Footprint-1]
R17  1.9K  [Y16241K90000T9R-Footprint-1]

### Ports
CS1 (out), CS2 (out), CS3 (out), CS4 (out), CS5 (out), CS6 (out), MISO (in), MOSI (out), RX (in), SCK (out), TX (out)

### Nets
3.3V (ISO): C28.1 MC.3.3V_2 R13.2
5V (ISO): C27.1 MC.VIN
G1: C27.2 C28.2 MC.G1 MC.G2 R14.1 R15.1 R16.1 R17.1  [also labelled 0V (ISO), G2, G3]
C1: MC.21 ; port CS1
C2: MC.20 ; port CS2
C3: MC.19 ; port CS3
C4: MC.18 ; port CS4
C5: MC.17 ; port CS5
C6: MC.16 ; port CS6
CRX1: MC.23 ; port RX
CTX1: MC.22 ; port TX
LED1: D4.A MC.0
LED2: D5.A MC.1
LED3: D6.A MC.2
LED4: D7.A MC.3
MISO: MC.12 R13.1 ; port MISO
MOSI: MC.11 ; port MOSI
SCK: MC.13 ; port SCK
NetD4_K: D4.K R14.2
NetD5_K: D5.K R15.2
NetD6_K: D6.K R16.2
NetD7_K: D7.K R17.2

Not connected (* = marked no-connect by the designer): MC 3.3V_1 4 5 6 7 8 9 10 14 15 G3 ON-OFF(ON/OFF) PGM(PROGRAM) VBAT

### Notes on the sheet
- Notes: 4 spare LEDs on spare GPIO pins for debugging. (5V-1.2V)/0.002A = 1.9K OHMS
- Labels drawn without touching a wire or pin: G3
- Section Leader Check:
- Date:
- Title:
- Revision
- Variant
- Project:
- Engineers:
- Sheet
- of

### Library data of the parts
C27 C28 = CMP-CAP-0013-1: CAP CER 10000PF 100V NP0 1206; Dielectric: C0G; Tolerance: 5%; Capacitance: 10nF; Width: 0.063inch; Max Operating Temperature: 125°C; Construction: Flat; Termination: SMD/SMT; RoHS Compliant: Yes; Voltage Rating: 100V; Radiation Hardening: No; Ratings: AEC-Q200; Package Quantity: 1; Case/Package: 1206; Voltage Rating (DC): 100V; Case Code (Metric): 3216; Case Code (Imperial): 1206; Packaging: Tape and Reel; Depth: 1.6mm; Min Operating Temperature: -55°C; Lead Free: Lead Free; Thickness: 0.037inch; Mount: Surface Mount; Height: 0.85mm; Length: 3.2mm; Series: GCM
D4 = CMP-025-000006-1: Red LED Indication - Discrete 1.75V 0805 (2012 Metric); Part Number: SML-210LTT86
D5 = CMP-025-000003-1: Green LED Indication - Discrete 1.75V 0805 (2012 Metric); Part Number: SML-210FTT86
D6 = CMP-025-000005-1: Yellow LED Indication - Discrete 1.75V 0805 (2012 Metric); Part Number: SML-211YTT86
D7 = CMP-025-000007-1: LED BLUE CLEAR 2012 SMD; Part Number: SML-MN2BCTT86C
MC = CMP-029-000001-2: Teensy 4.0 Microcontroller Board
R13 = CMP-RES-0160-1: RED SMD 5K OHM 1/10W 0805
R14-R17 = CMP-RES-0159-1: RES SMD 1.9K OHM 1/5W 0805; Resistance: 1.9kR; Max Power Dissipation: 200mW; Tolerance: 0.01%; Temperature Coefficient: 0.2ppm/°C; Series: VSMP; Features: Moisture Resistant; Case Code (Metric): 2012; Package Quantity: 1000; Length: 0.08inch; Number of Terminations: 2; Height: 0.025inch; Resistor Type: Metal Foil; Min Operating Temperature: -55°C; Width: 0.05inch; RoHS Compliant: Yes; Max Operating Temperature: 150°C; Case Code (Imperial): 0805; Case/Package: 0805; Packaging: Tape and Reel

## Sheet Temp Bank.SchDoc
size A3; SheetNumber: 5; SheetTotal: 5
Used 6 times, as channels TB1, TB2, TB3, TB4, TB5, TB6. Parts and nets are listed once, with the designators drawn on the sheet.
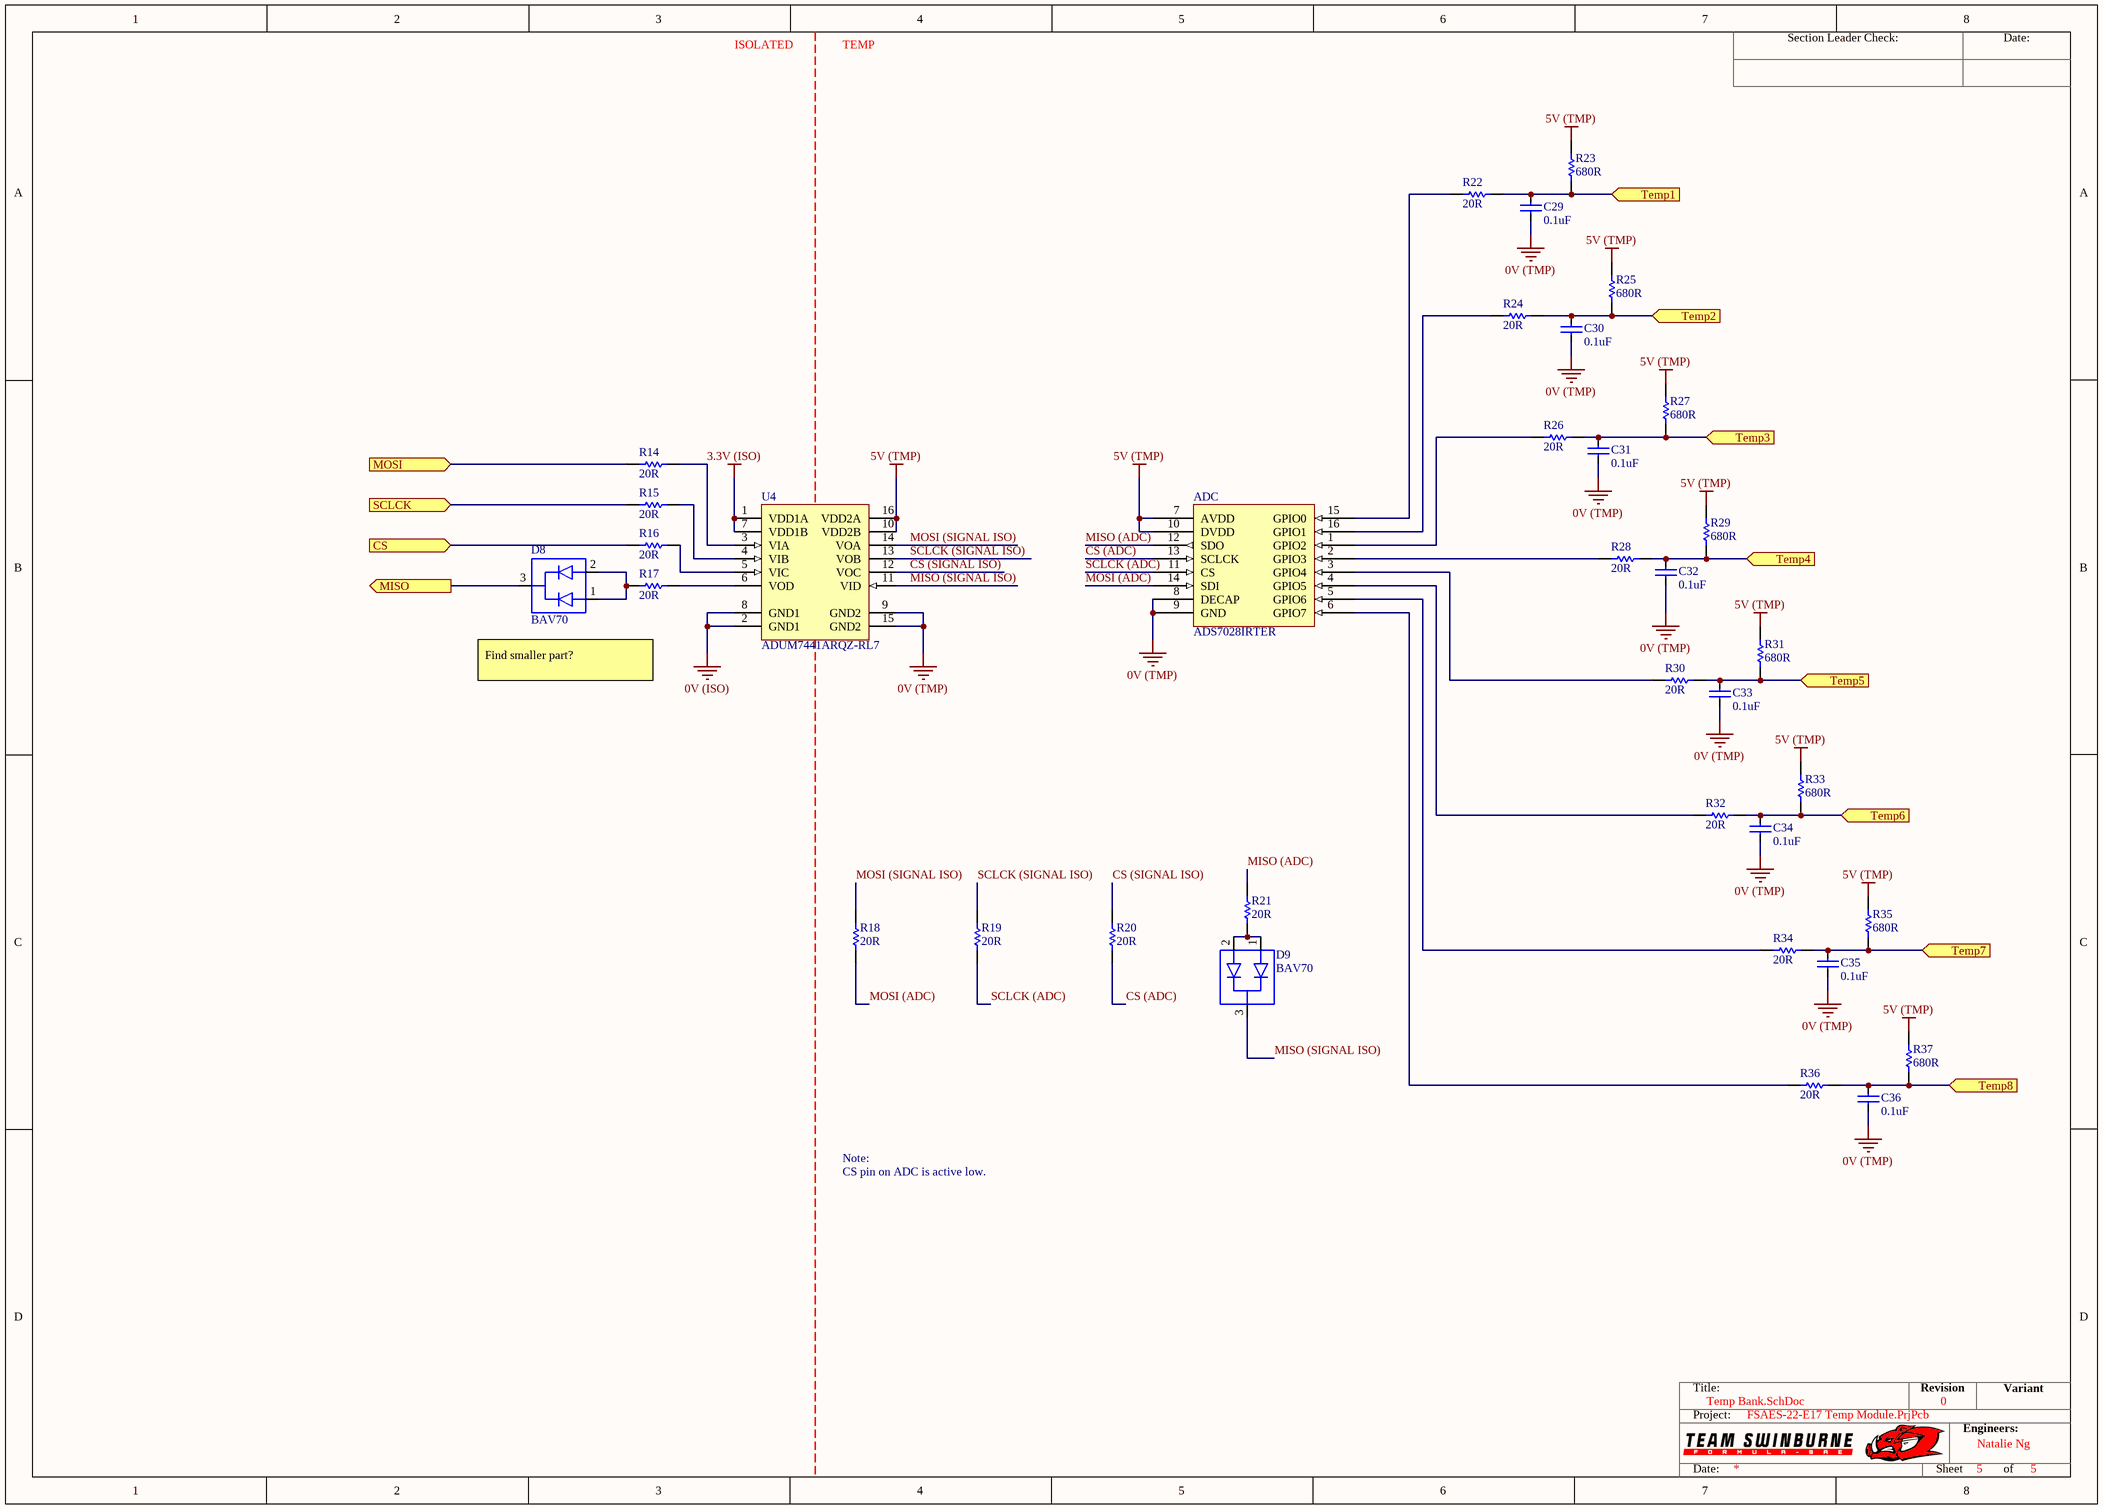
[diagram p4: Temp Bank.SchDoc]

### Parts
ADC  ADS7028IRTER  [QFN50P300X300X80_HS-17N]
C29  0.1uF  [0805]
C30  0.1uF  [0805]
C31  0.1uF  [0805]
C32  0.1uF  [0805]
C33  0.1uF  [0805]
C34  0.1uF  [0805]
C35  0.1uF  [0805]
C36  0.1uF  [0805]
D8  BAV70  [BAV70-Footprint-1]
D9  BAV70  [BAV70-Footprint-1]
R14  20R  [RESC0603]
R15  20R  [RESC0603]
R16  20R  [RESC0603]
R17  20R  [RESC0603]
R18  20R  [RESC0603]
R19  20R  [RESC0603]
R20  20R  [RESC0603]
R21  20R  [RESC0603]
R22  20R  [RESC0603]
R23  680R  [0805]
R24  20R  [RESC0603]
R25  680R  [0805]
R26  20R  [RESC0603]
R27  680R  [0805]
R28  20R  [RESC0603]
R29  680R  [0805]
R30  20R  [RESC0603]
R31  680R  [0805]
R32  20R  [RESC0603]
R33  680R  [0805]
R34  20R  [RESC0603]
R35  680R  [0805]
R36  20R  [RESC0603]
R37  680R  [0805]
U4  ADUM7441ARQZ-RL7  [ADI-RQ-16_M]

### Ports
CS (in), MISO (out), MOSI (in), SCLCK (in), Temp1 (in), Temp2 (in), Temp3 (in), Temp4 (in), Temp5 (in), Temp6 (in), Temp7 (in), Temp8 (in)

### Nets
0V (ISO): U4.2(GND1) U4.8(GND1)
0V (TMP): ADC.8(DECAP) ADC.9(GND) C29.2 C30.2 C31.2 C32.2 C33.2 C34.2 C35.2 C36.2 U4.9(GND2) U4.15(GND2)
3.3V (ISO): U4.1(VDD1A) U4.7(VDD1B)
5V (TMP): ADC.7(AVDD) ADC.10(DVDD) R23.2 R25.2 R27.2 R29.2 R31.2 R33.2 R35.2 R37.2 U4.10(VDD2B) U4.16(VDD2A)
CS: R16.1 ; port CS
CS (ADC): ADC.13(SCLCK) R20.1
CS (SIGNAL ISO): R20.2 U4.12(VOC)
MISO: D8.3(CC) ; port MISO
MISO (ADC): ADC.12(SDO) R21.2
MISO (SIGNAL ISO): D9.3(CC) U4.11(VID)
MOSI: R14.1 ; port MOSI
MOSI (ADC): ADC.14(SDI) R18.1
MOSI (SIGNAL ISO): R18.2 U4.14(VOA)
SCLCK: R15.1 ; port SCLCK
SCLCK (ADC): ADC.11(CS) R19.1
SCLCK (SIGNAL ISO): R19.2 U4.13(VOB)
Temp1: C29.1 R22.2 R23.1 ; port Temp1
Temp2: C30.1 R24.2 R25.1 ; port Temp2
Temp3: C31.1 R26.2 R27.1 ; port Temp3
Temp4: C32.1 R28.2 R29.1 ; port Temp4
Temp5: C33.1 R30.2 R31.1 ; port Temp5
Temp6: C34.1 R32.2 R33.1 ; port Temp6
Temp7: C35.1 R34.2 R35.1 ; port Temp7
Temp8: C36.1 R36.2 R37.1 ; port Temp8
NetADC_1: ADC.1(GPIO2) R26.1
NetADC_2: ADC.2(GPIO3) R28.1
NetADC_3: ADC.3(GPIO4) R30.1
NetADC_4: ADC.4(GPIO5) R32.1
NetADC_5: ADC.5(GPIO6) R34.1
NetADC_6: ADC.6(GPIO7) R36.1
NetADC_15: ADC.15(GPIO0) R22.1
NetADC_16: ADC.16(GPIO1) R24.1
NetD8_1: D8.1(A1) D8.2(A2) R17.1
NetD9_1: D9.1(A1) D9.2(A2) R21.1
NetR14_2: R14.2 U4.3(VIA)
NetR15_2: R15.2 U4.4(VIB)
NetR16_2: R16.2 U4.5(VIC)
NetR17_2: R17.2 U4.6(VOD)

### Channels
TB1: designators end in _TB1; ports CS=C1 MISO=MISO_1 MOSI=MOSI SCLCK=SCK Temp1=TempBank1_1 Temp2=TempBank1_2 Temp3=TempBank1_3 Temp4=TempBank1_4 Temp5=TempBank1_5 Temp6=TempBank1_6 Temp7=TempBank1_7 Temp8=TempBank1_8
TB2: designators end in _TB2; ports CS=C2 MISO=MISO_2 MOSI=MOSI SCLCK=SCK Temp1=TempBank2_1 Temp2=TempBank2_2 Temp3=TempBank2_3 Temp4=TempBank2_4 Temp5=TempBank2_5 Temp6=TempBank2_6 Temp7=TempBank2_7 Temp8=TempBank2_8
TB3: designators end in _TB3; ports CS=C3 MISO=MISO_3 MOSI=MOSI SCLCK=SCK Temp1=TempBank3_1 Temp2=TempBank3_2 Temp3=TempBank3_3 Temp4=TempBank3_4 Temp5=TempBank3_5 Temp6=TempBank3_6 Temp7=TempBank3_7 Temp8=TempBank3_8
TB4: designators end in _TB4; ports CS=C4 MISO=MISO_4 MOSI=MOSI SCLCK=SCK Temp1=TempBank4_1 Temp2=TempBank4_2 Temp3=TempBank4_3 Temp4=TempBank4_4 Temp5=TempBank4_5 Temp6=TempBank4_6 Temp7=TempBank4_7 Temp8=TempBank4_8
TB5: designators end in _TB5; ports CS=C5 MISO=MISO_5 MOSI=MOSI SCLCK=SCK Temp1=TempBank5_1 Temp2=TempBank5_2 Temp3=TempBank5_3 Temp4=TempBank5_4 Temp5=TempBank5_5 Temp6=TempBank5_6 Temp7=TempBank5_7 Temp8=TempBank5_8
TB6: designators end in _TB6; ports CS=C6 MISO=MISO_6 MOSI=MOSI SCLCK=SCK Temp1=TempBank6_1 Temp2=TempBank6_2 Temp3=TempBank6_3 Temp4=TempBank6_4 Temp5=TempBank6_5 Temp6=TempBank6_6 Temp7=TempBank6_7 Temp8=TempBank6_8

### Notes on the sheet
- ISOLATED
- TEMP
- Find smaller part?
- Note:
- CS pin on ADC is active low.
- Section Leader Check:
- Date:
- Title:
- Revision
- Variant
- Project:
- Engineers:
- Sheet
- of

### Library data of the parts
ADC = CMP-001-0002-8: Small 8-channel 12-bit analog-to-digital converter (ADC) with SPI, GPIOs and CRC 16-WQFN -40 to 85
C29-C36 = CMP-00018-1: Cap Ceramic 0.1uF 25V X7R 10% Pad SMD 0805 125C Automotive T/R; Capacitance: 100nF; Max Operating Temperature: 125°C; RoHS Compliant: Yes; Series: GCM; Case Code (Metric): 2012; Thickness: 0.055inch; Depth: 1.25mm; Width: 1.25mm; Package Quantity: 3000; Case Code (Imperial): 0805; Voltage Rating (DC): 25V; Dielectric: X7R; Construction: Flat; Height: 1.25mm; Ratings: AEC-Q200; Mount: Surface Mount; Voltage Rating: 25V; Tolerance: 10%; Length: 2mm; Case/Package: 0805; Packaging: Tape and Reel; Min Operating Temperature: -55°C; Radiation Hardening: No; Termination: SMD/SMT
D8 D9 = CMP-004-00001-1: DIODE ARRAY GP 70V 200mA SOT23-3; RoHS Compliant: No
R14-R22 R24 R26 R28 R30 R32 R34 R36 = CMP-RES-0043-1: RES SMD 20 OHM JUMPER 1/10W 0603; Voltage Rating: 50V; Tolerance: 1%; Power Rating: 100mW; Case/Package: 0603; Min Operating Temperature: -55°C; Max Operating Temperature: 155°C
R23 R25 R27 R29 R31 R33 R35 R37 = CMP-037-000298-3: RC0805FR07680RL; Rated Voltage: 0.125W; Tolerance: 0.01; Material: FR-07; Digikey Part Number: 311-680CRCT-ND; Value: 680R
U4 = CMP-001-0005-5: Digital Isolator CMOS 4-CH 1Mbps 16-Pin QSOP T/R; Pulse Width Distortion (PWD): 25ns; Nominal Supply Current: 4.1mA; Data Rate: 25Mbps; Turn-On Delay Time: 56ns; Max Supply Voltage: 5.5V; Isolated Power: No; Min Supply Voltage: 3V; Propagation Delay: 75ns; Channel Type: Unidirectional; Number of Channels: 4; Lead Free: Contains Lead; Number of Pins: 16; Contact Plating: Tin,Matte; RoHS Compliant: Yes; Package Quantity: 1000; Type: General Purpose; Supply Current: 4.1mA; Case/Package: QSOP; Max Operating Temperature: 105°C; Packaging: Tape and Reel; Series: iCoupler®; Min Operating Temperature: -40°C

## Nets that join several sheets
0V (TMP): Top Level (6 pins), Power Supply (5 pins), TB1 (12 pins), TB2 (12 pins), TB3 (12 pins), TB4 (12 pins), TB5 (12 pins), TB6 (12 pins)
3.3V (ISO): Power Supply (5 pins), CAN (C25.1 C26.1 U4.6), Microcontroller (C28.1 MC.3.3V_2 R13.2), TB1 (U4_TB1.1 U4_TB1.7), TB2 (U4_TB2.1 U4_TB2.7), TB3 (U4_TB3.1 U4_TB3.7), TB4 (U4_TB4.1 U4_TB4.7), TB5 (U4_TB5.1 U4_TB5.7), TB6 (U4_TB6.1 U4_TB6.7)
5V (ISO): Power Supply (11 pins), CAN (C23.2 C24.1 U4.8), Microcontroller (C27.1 MC.VIN)
5V (TMP): Power Supply (5V_(TMP).1 C13.1 RL_5V_(TMP).A U2.5), TB1 (12 pins), TB2 (12 pins), TB3 (12 pins), TB4 (12 pins), TB5 (12 pins), TB6 (12 pins)
G1: Power Supply (14 pins), CAN (9 pins), Microcontroller (8 pins), TB1 (U4_TB1.2 U4_TB1.8), TB2 (U4_TB2.2 U4_TB2.8), TB3 (U4_TB3.2 U4_TB3.8), TB4 (U4_TB4.2 U4_TB4.8), TB5 (U4_TB5.2 U4_TB5.8), TB6 (U4_TB6.2 U4_TB6.8)
C1: Microcontroller (MC.21), TB1 (R16_TB1.1)
C2: Microcontroller (MC.20), TB2 (R16_TB2.1)
C3: Microcontroller (MC.19), TB3 (R16_TB3.1)
C4: Microcontroller (MC.18), TB4 (R16_TB4.1)
C5: Microcontroller (MC.17), TB5 (R16_TB5.1)
C6: Microcontroller (MC.16), TB6 (R16_TB6.1)
CAN_N: Top Level (P3#1.6), CAN (C16.2 CANL.1 L2.1 R7.1)
CAN_P: Top Level (P3#1.3), CAN (C15.2 CANH.1 L2.2 R5.2)
CANS: Top Level (P3#1.5), CAN (16 pins)
CRX1: CAN (U4.4), Microcontroller (MC.23)
CTX1: CAN (U4.5), Microcontroller (MC.22)
GLV+: Top Level (P3#1.1), Power Supply (F1.1 GLV+.1)
GLV-: Top Level (P3#1.4), Power Supply (6 pins)
MOSI: Microcontroller (MC.11), TB1 (R14_TB1.1), TB2 (R14_TB2.1), TB3 (R14_TB3.1), TB4 (R14_TB4.1), TB5 (R14_TB5.1), TB6 (R14_TB6.1)
SCK: Microcontroller (MC.13), TB1 (R15_TB1.1), TB2 (R15_TB2.1), TB3 (R15_TB3.1), TB4 (R15_TB4.1), TB5 (R15_TB5.1), TB6 (R15_TB6.1)
TempBank1_1: Top Level (P1.1), TB1 (C29_TB1.1 R22_TB1.2 R23_TB1.1)
TempBank1_2: Top Level (P1.2), TB1 (C30_TB1.1 R24_TB1.2 R25_TB1.1)
TempBank1_3: Top Level (P1.3), TB1 (C31_TB1.1 R26_TB1.2 R27_TB1.1)
TempBank1_4: Top Level (P1.4), TB1 (C32_TB1.1 R28_TB1.2 R29_TB1.1)
TempBank1_5: Top Level (P1.5), TB1 (C33_TB1.1 R30_TB1.2 R31_TB1.1)
TempBank1_6: Top Level (P1.6), TB1 (C34_TB1.1 R32_TB1.2 R33_TB1.1)
TempBank1_7: Top Level (P1.7), TB1 (C35_TB1.1 R34_TB1.2 R35_TB1.1)
TempBank1_8: Top Level (P1.8), TB1 (C36_TB1.1 R36_TB1.2 R37_TB1.1)
TempBank2_1: Top Level (P2.1), TB2 (C29_TB2.1 R22_TB2.2 R23_TB2.1)
TempBank2_2: Top Level (P2.2), TB2 (C30_TB2.1 R24_TB2.2 R25_TB2.1)
TempBank2_3: Top Level (P2.3), TB2 (C31_TB2.1 R26_TB2.2 R27_TB2.1)
TempBank2_4: Top Level (P2.4), TB2 (C32_TB2.1 R28_TB2.2 R29_TB2.1)
TempBank2_5: Top Level (P2.5), TB2 (C33_TB2.1 R30_TB2.2 R31_TB2.1)
TempBank2_6: Top Level (P2.6), TB2 (C34_TB2.1 R32_TB2.2 R33_TB2.1)
TempBank2_7: Top Level (P2.7), TB2 (C35_TB2.1 R34_TB2.2 R35_TB2.1)
TempBank2_8: Top Level (P2.8), TB2 (C36_TB2.1 R36_TB2.2 R37_TB2.1)
TempBank3_1: Top Level (P3#2.1), TB3 (C29_TB3.1 R22_TB3.2 R23_TB3.1)
TempBank3_2: Top Level (P3#2.2), TB3 (C30_TB3.1 R24_TB3.2 R25_TB3.1)
TempBank3_3: Top Level (P3#2.3), TB3 (C31_TB3.1 R26_TB3.2 R27_TB3.1)
TempBank3_4: Top Level (P3#2.4), TB3 (C32_TB3.1 R28_TB3.2 R29_TB3.1)
TempBank3_5: Top Level (P3#2.5), TB3 (C33_TB3.1 R30_TB3.2 R31_TB3.1)
TempBank3_6: Top Level (P3#2.6), TB3 (C34_TB3.1 R32_TB3.2 R33_TB3.1)
TempBank3_7: Top Level (P3#2.7), TB3 (C35_TB3.1 R34_TB3.2 R35_TB3.1)
TempBank3_8: Top Level (P3#2.8), TB3 (C36_TB3.1 R36_TB3.2 R37_TB3.1)
TempBank4_1: Top Level (P4.1), TB4 (C29_TB4.1 R22_TB4.2 R23_TB4.1)
TempBank4_2: Top Level (P4.2), TB4 (C30_TB4.1 R24_TB4.2 R25_TB4.1)
TempBank4_3: Top Level (P4.3), TB4 (C31_TB4.1 R26_TB4.2 R27_TB4.1)
TempBank4_4: Top Level (P4.4), TB4 (C32_TB4.1 R28_TB4.2 R29_TB4.1)
TempBank4_5: Top Level (P4.5), TB4 (C33_TB4.1 R30_TB4.2 R31_TB4.1)
TempBank4_6: Top Level (P4.6), TB4 (C34_TB4.1 R32_TB4.2 R33_TB4.1)
TempBank4_7: Top Level (P4.7), TB4 (C35_TB4.1 R34_TB4.2 R35_TB4.1)
TempBank4_8: Top Level (P4.8), TB4 (C36_TB4.1 R36_TB4.2 R37_TB4.1)
TempBank5_1: Top Level (P5.1), TB5 (C29_TB5.1 R22_TB5.2 R23_TB5.1)
TempBank5_2: Top Level (P5.2), TB5 (C30_TB5.1 R24_TB5.2 R25_TB5.1)
TempBank5_3: Top Level (P5.3), TB5 (C31_TB5.1 R26_TB5.2 R27_TB5.1)
TempBank5_4: Top Level (P5.4), TB5 (C32_TB5.1 R28_TB5.2 R29_TB5.1)
TempBank5_5: Top Level (P5.5), TB5 (C33_TB5.1 R30_TB5.2 R31_TB5.1)
TempBank5_6: Top Level (P5.6), TB5 (C34_TB5.1 R32_TB5.2 R33_TB5.1)
TempBank5_7: Top Level (P5.7), TB5 (C35_TB5.1 R34_TB5.2 R35_TB5.1)
TempBank5_8: Top Level (P5.8), TB5 (C36_TB5.1 R36_TB5.2 R37_TB5.1)
TempBank6_1: Top Level (P6.1), TB6 (C29_TB6.1 R22_TB6.2 R23_TB6.1)
TempBank6_2: Top Level (P6.2), TB6 (C30_TB6.1 R24_TB6.2 R25_TB6.1)
TempBank6_3: Top Level (P6.3), TB6 (C31_TB6.1 R26_TB6.2 R27_TB6.1)
TempBank6_4: Top Level (P6.4), TB6 (C32_TB6.1 R28_TB6.2 R29_TB6.1)
TempBank6_5: Top Level (P6.5), TB6 (C33_TB6.1 R30_TB6.2 R31_TB6.1)
TempBank6_6: Top Level (P6.6), TB6 (C34_TB6.1 R32_TB6.2 R33_TB6.1)
TempBank6_7: Top Level (P6.7), TB6 (C35_TB6.1 R34_TB6.2 R35_TB6.1)
TempBank6_8: Top Level (P6.8), TB6 (C36_TB6.1 R36_TB6.2 R37_TB6.1)